# Altium schematic sheet Power.SchDoc: POWER
size A4; Author: MOG; CompanyName: GIE GROUP; DrawnBy: MOG; Organization: Gie SA; Address1: Galicia 52; Address2: Mar del Plata; Address3: Buenos Aires; Address4: Argentina; DocumentNumber: 14; Revision: 0.0; SheetNumber: 11; SheetTotal: 14; Project: CP DATALOGGER; PageSetup: Record=PageOptions|CenterHorizontal=True|CenterVertical=True|PrintScale=0.94|XCorrection=1.00|YCorrection=1.00|PrintKind=0|BorderSize=5000000|LeftOffset=0|BottomOffset=0|Orientation=2|PaperLength=1000|PaperWidth=1000|Scale=100|PaperSource=7|PrintQuality=720|MediaType=1|DitherType=10|PaperKind=A4|PrintScaleMode=1
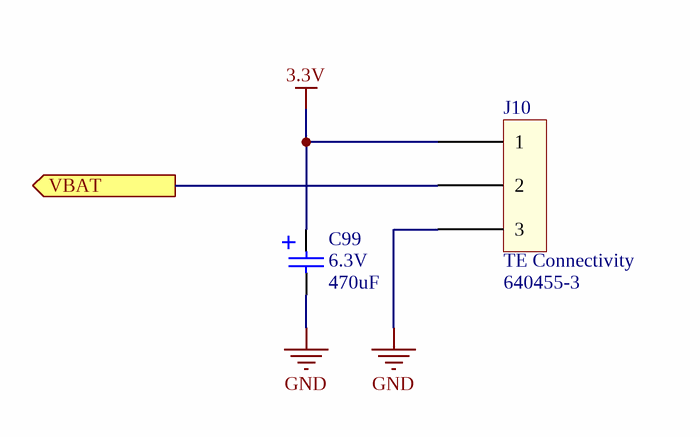
[diagram p0: Power.SchDoc]

## Parts
C99  value 470uF  Voltage: 6.3V  [CAP_ALUM_SIZE_F]  (hidden comment: EEE-FK0J471P)
J10  Manufacturer: TE Connectivity  [TE-640455-3]  (hidden comment: 640455-3)

## Ports
VBAT (out)

## Nets
3.3V: C99.1 J10.1
GND: C99.2 J10.3
VBAT: J10.2 ; port VBAT

## Notes on the sheet
- PROYECTO:
- Rev:
- NOMBRE:
- FECHA:
- REALIZO:
- REVISO:
- APROBO:
- PAG:
- HOJA:
- DE
- A4

## Library data of the parts
C99 = EEE-FK0J471P: CAP ALUM 470UF 20% 6.3V SMD; Manufacturer: Panasonic; Part}Number: EEE-FK0J471P
J10 = 640455-3: CONN HEADER RTANG 3POS .100 TIN; Mating Conn: 1375820-3; Supplier 1: Digi-Key; Supplier Part Number 1: A19451-ND; Supplier 2: Mouser; Supplier Part Number 2: 571-6404553; PartNumber: 640455-3